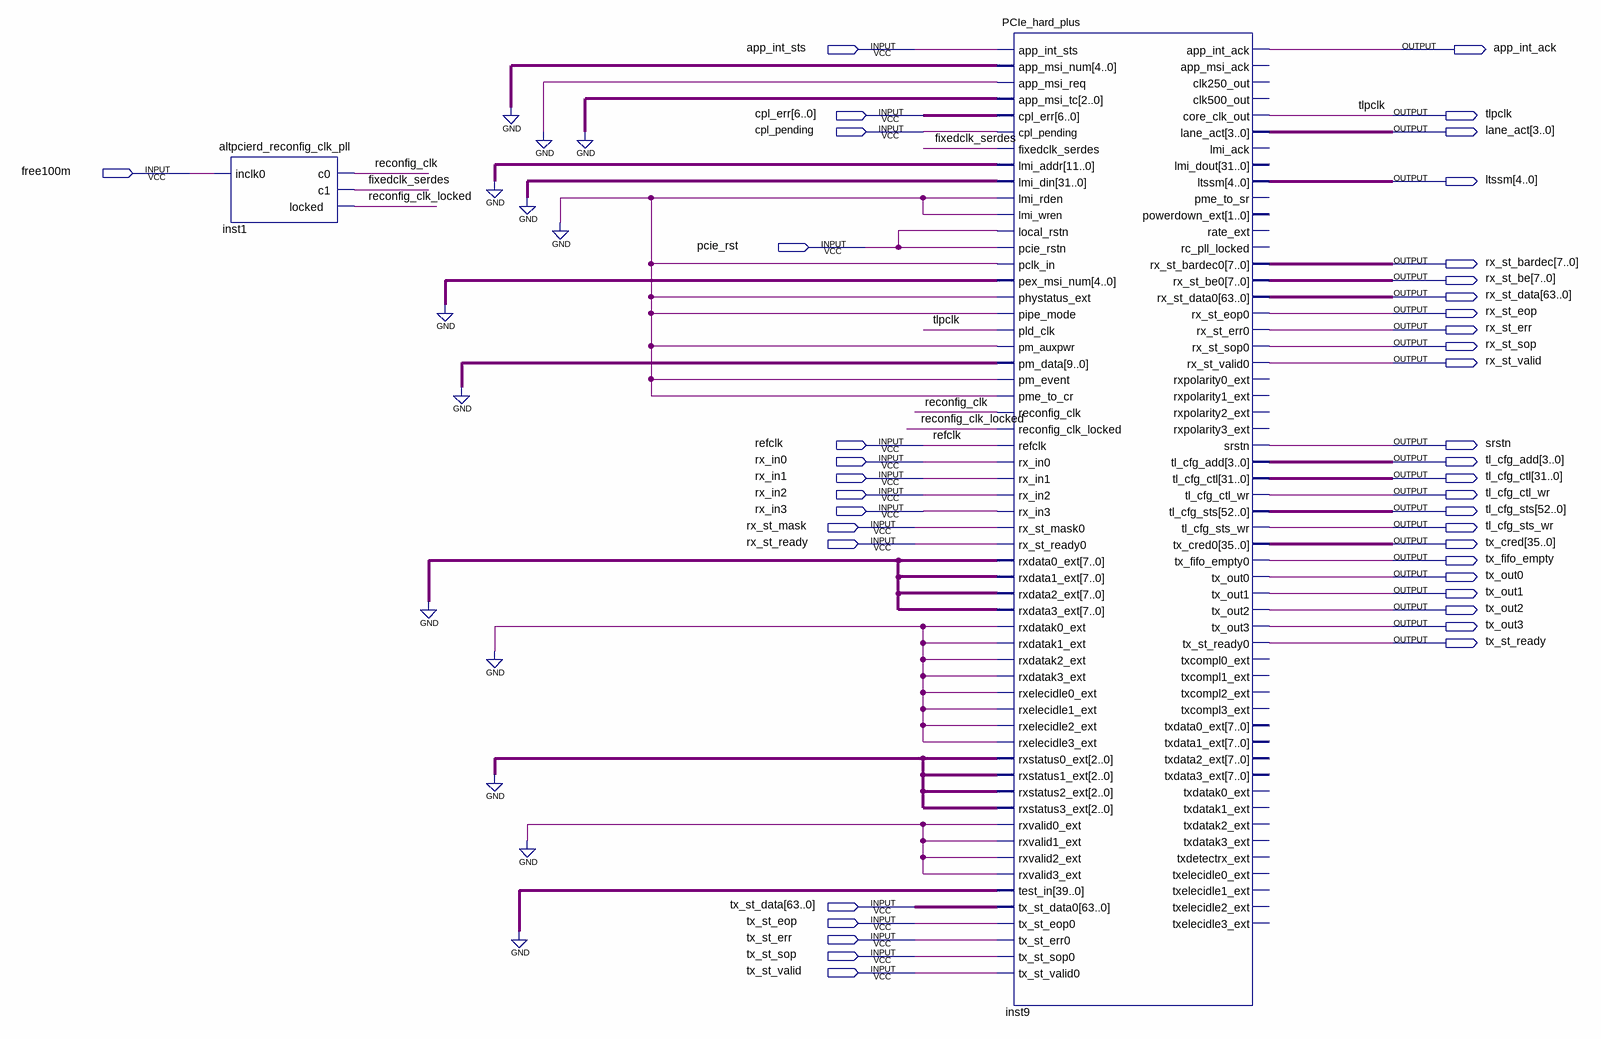
[diagram p0: schematic sheet]
// Quartus schematic PCIEbot.bdf as structural Verilog: 2 symbols, 41 pins
module PCIEbot (
  input  app_int_sts,
  input  [6:0] cpl_err,
  input  cpl_pending,
  input  free100m,
  input  pcie_rst,
  input  refclk,
  input  rx_in0,
  input  rx_in1,
  input  rx_in2,
  input  rx_in3,
  input  rx_st_mask,
  input  rx_st_ready,
  input  [63:0] tx_st_data,
  input  tx_st_eop,
  input  tx_st_err,
  input  tx_st_sop,
  input  tx_st_valid,
  output app_int_ack,
  output tlpclk,
  output [3:0] lane_act,
  output [4:0] ltssm,
  output [7:0] rx_st_bardec,
  output [7:0] rx_st_be,
  output [63:0] rx_st_data,
  output rx_st_eop,
  output rx_st_err,
  output rx_st_sop,
  output rx_st_valid,
  output srstn,
  output [3:0] tl_cfg_add,
  output [31:0] tl_cfg_ctl,
  output tl_cfg_ctl_wr,
  output [52:0] tl_cfg_sts,
  output tl_cfg_sts_wr,
  output [35:0] tx_cred,
  output tx_fifo_empty,
  output tx_out0,
  output tx_out1,
  output tx_out2,
  output tx_out3,
  output tx_st_ready
);

  wire fixedclk_serdes, reconfig_clk, reconfig_clk_locked;

  altpcierd_reconfig_clk_pll inst1 (
    .inclk0(free100m), .c0(reconfig_clk), .c1(fixedclk_serdes), .locked(reconfig_clk_locked));
  PCIe_hard_plus inst9 (
    .app_int_sts(app_int_sts), .app_msi_num({5{1'b0}}), .app_msi_req(1'b0), .app_msi_tc(3'b000),
    .cpl_err(cpl_err), .cpl_pending(cpl_pending), .fixedclk_serdes(fixedclk_serdes), .lmi_addr({12{1'b0}}),
    .lmi_din({32{1'b0}}), .lmi_rden(1'b0), .lmi_wren(1'b0), .local_rstn(pcie_rst), .pcie_rstn(pcie_rst),
    .pclk_in(1'b0), .pex_msi_num({5{1'b0}}), .phystatus_ext(1'b0), .pipe_mode(1'b0), .pld_clk(tlpclk),
    .pm_auxpwr(1'b0), .pm_data({10{1'b0}}), .pm_event(1'b0), .pme_to_cr(1'b0), .reconfig_clk(reconfig_clk),
    .reconfig_clk_locked(reconfig_clk_locked), .refclk(refclk), .rx_in0(rx_in0), .rx_in1(rx_in1),
    .rx_in2(rx_in2), .rx_in3(rx_in3), .rx_st_mask0(rx_st_mask), .rx_st_ready0(rx_st_ready),
    .rxdata0_ext({8{1'b0}}), .rxdata1_ext({8{1'b0}}), .rxdata2_ext({8{1'b0}}), .rxdata3_ext({8{1'b0}}),
    .rxdatak0_ext(1'b0), .rxdatak1_ext(1'b0), .rxdatak2_ext(1'b0), .rxdatak3_ext(1'b0),
    .rxelecidle0_ext(1'b0), .rxelecidle1_ext(1'b0), .rxelecidle2_ext(1'b0), .rxelecidle3_ext(1'b0),
    .rxstatus0_ext(3'b000), .rxstatus1_ext(3'b000), .rxstatus2_ext(3'b000), .rxstatus3_ext(3'b000),
    .rxvalid0_ext(1'b0), .rxvalid1_ext(1'b0), .rxvalid2_ext(1'b0), .rxvalid3_ext(1'b0), .test_in({40{1'b0}}),
    .tx_st_data0(tx_st_data), .tx_st_eop0(tx_st_eop), .tx_st_err0(tx_st_err), .tx_st_sop0(tx_st_sop),
    .tx_st_valid0(tx_st_valid), .app_int_ack(app_int_ack), .core_clk_out(tlpclk), .lane_act(lane_act),
    .ltssm(ltssm), .rx_st_bardec0(rx_st_bardec), .rx_st_be0(rx_st_be), .rx_st_data0(rx_st_data),
    .rx_st_eop0(rx_st_eop), .rx_st_err0(rx_st_err), .rx_st_sop0(rx_st_sop), .rx_st_valid0(rx_st_valid),
    .srstn(srstn), .tl_cfg_add(tl_cfg_add), .tl_cfg_ctl(tl_cfg_ctl), .tl_cfg_ctl_wr(tl_cfg_ctl_wr),
    .tl_cfg_sts(tl_cfg_sts), .tl_cfg_sts_wr(tl_cfg_sts_wr), .tx_cred0(tx_cred),
    .tx_fifo_empty0(tx_fifo_empty), .tx_out0(tx_out0), .tx_out1(tx_out1), .tx_out2(tx_out2),
    .tx_out3(tx_out3), .tx_st_ready0(tx_st_ready));  // open: app_msi_ack, clk250_out, clk500_out, lmi_ack, lmi_dout, pme_to_sr, powerdown_ext, rate_ext, rc_pll_locked, rxpolarity0_ext, rxpolarity1_ext, rxpolarity2_ext, rxpolarity3_ext, txcompl0_ext, txcompl1_ext, txcompl2_ext, txcompl3_ext, txdata0_ext, txdata1_ext, txdata2_ext, txdata3_ext, txdatak0_ext, txdatak1_ext, txdatak2_ext, txdatak3_ext, txdetectrx_ext, txelecidle0_ext, txelecidle1_ext, txelecidle2_ext, txelecidle3_ext
endmodule
